# Altium schematic sheet WGA_IR_P.SchDoc
size A3
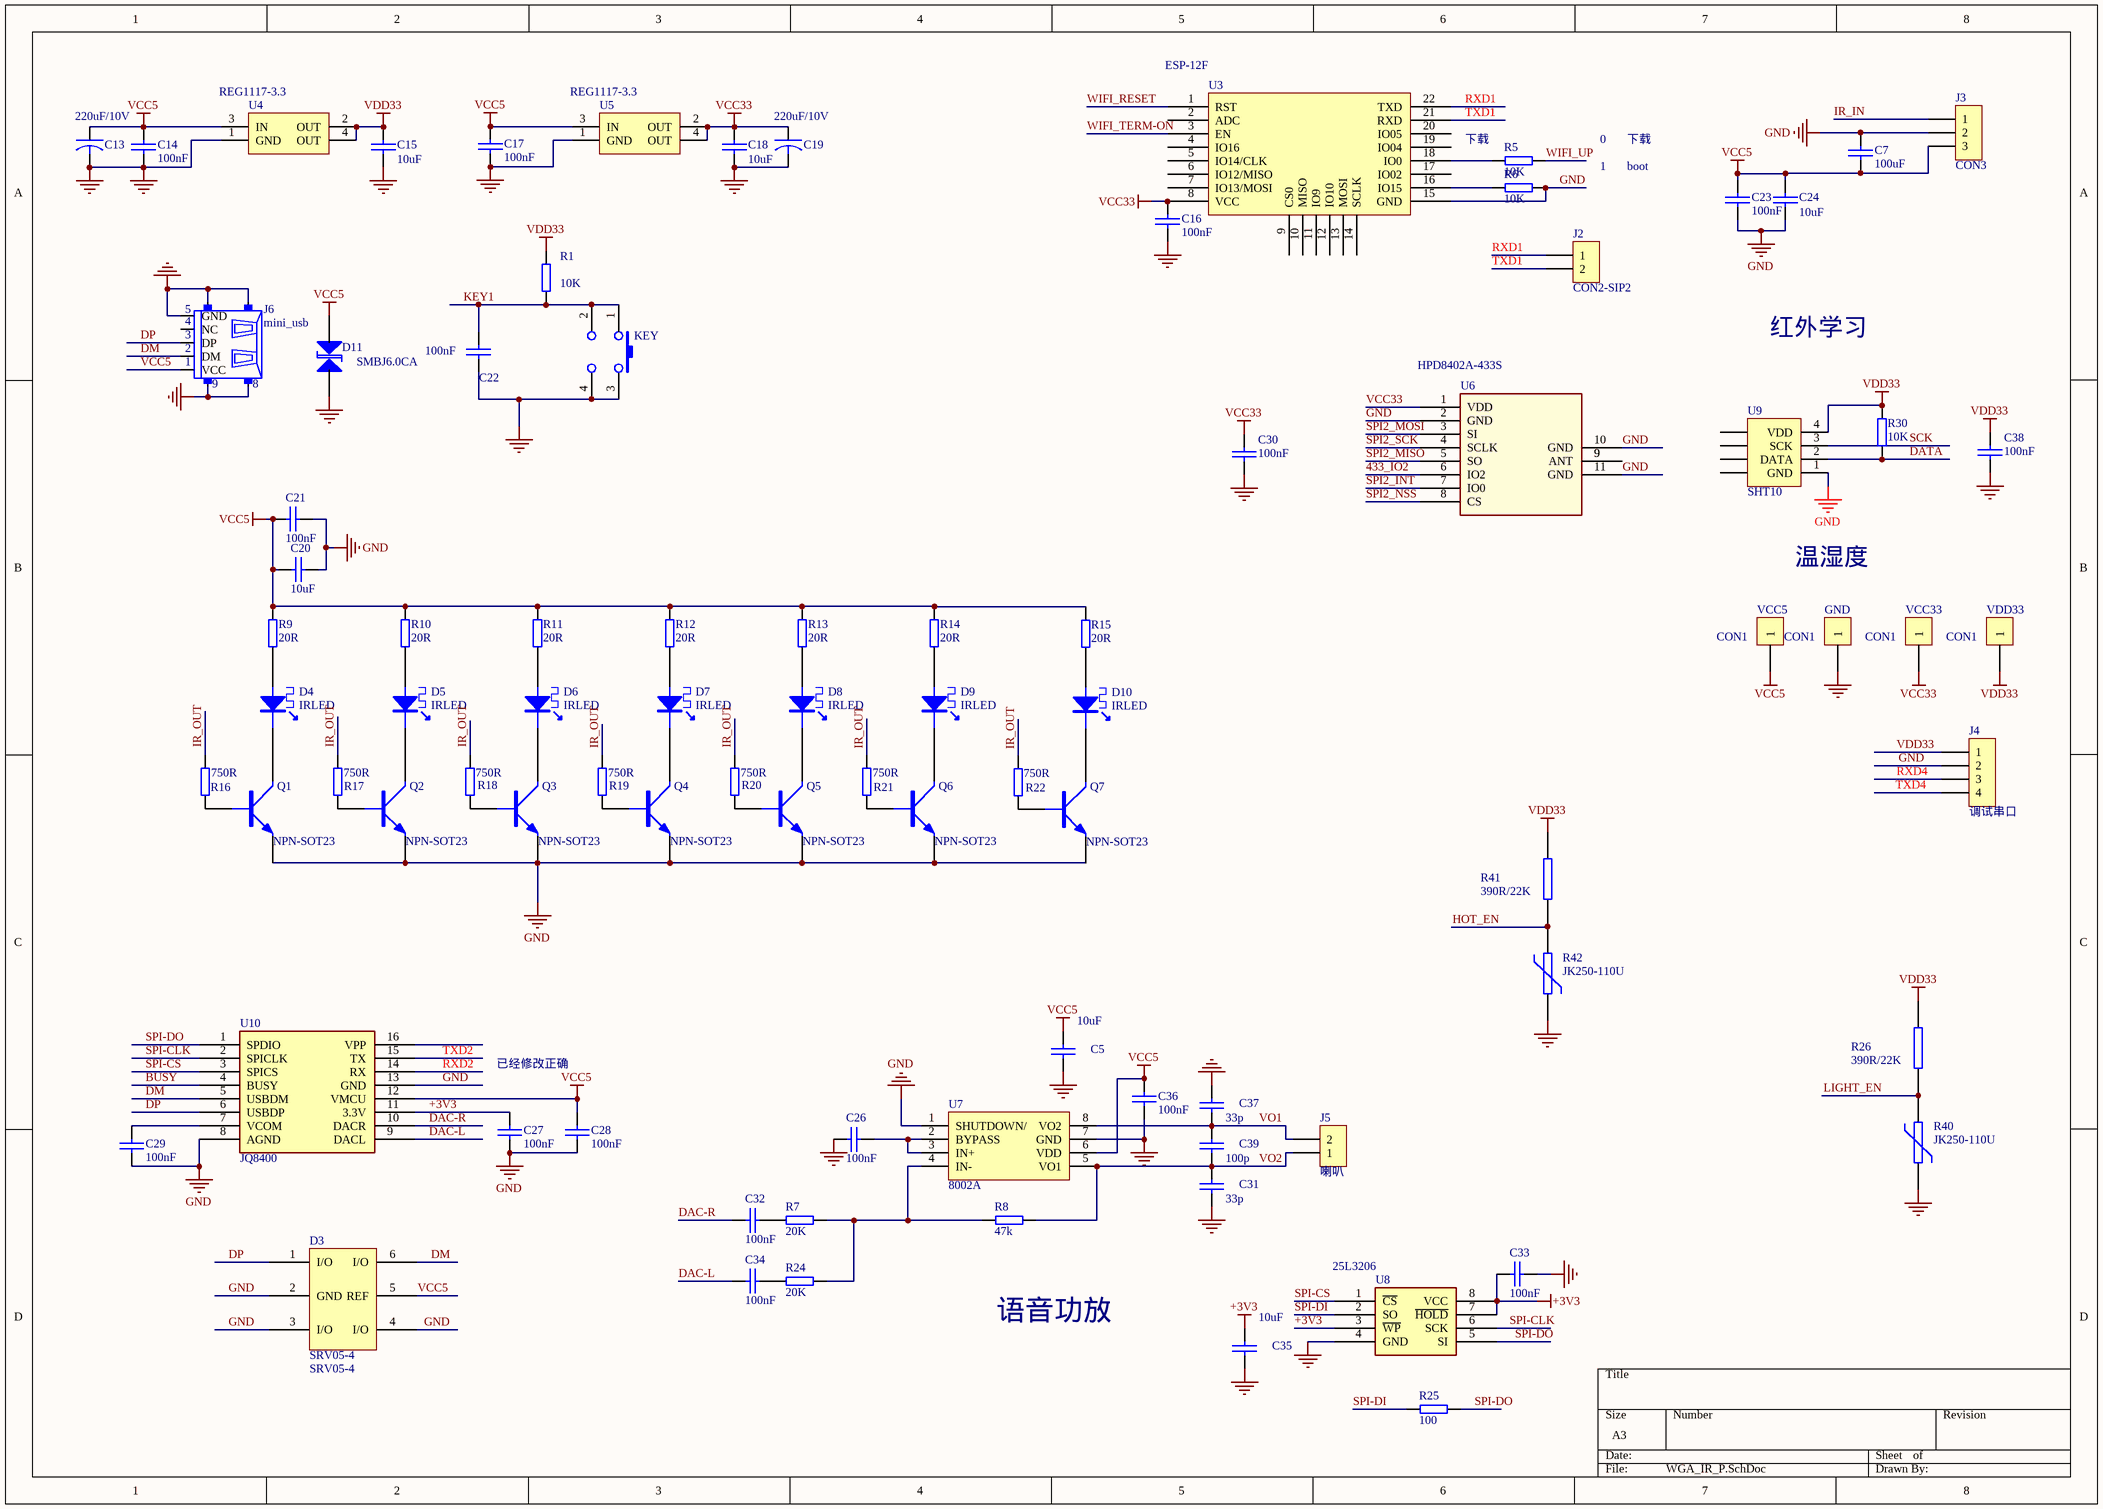
[diagram p0: WGA_IR_P.SchDoc]

## Parts
C5  value 10uF  [C0805]  (hidden comment: CC0805ZKY5V6BB106)
C7  value 100uF  [C0603]  (hidden comment: CC0603JRNPO9BN101)
C13  value 220uF/10V  [C6032]  (hidden comment: TAJC227K010RNJ)
C14  value 100nF  [C0603]  (hidden comment: CC0603ZRY5V9BB104)
C15  value 10uF  [C0805]  (hidden comment: CC0805ZKY5V6BB106)
C16  value 100nF  [C0603]  (hidden comment: CC0603ZRY5V9BB104)
C17  value 100nF  [C0603]  (hidden comment: CC0603ZRY5V9BB104)
C18  value 10uF  [C0805]  (hidden comment: CC0805ZKY5V6BB106)
C19  value 220uF/10V  [C6032]  (hidden comment: TAJC227K010RNJ)
C20  value 10uF  [C0805]  (hidden comment: CC0805ZKY5V6BB106)
C21  value 100nF  [C0603]  (hidden comment: CC0603ZRY5V9BB104)
C22  value 100nF  [C0603]  (hidden comment: CC0603ZRY5V9BB104)
C23  value 100nF  [C0603]  (hidden comment: CC0603ZRY5V9BB104)
C24  value 10uF  [C0805]  (hidden comment: CC0805ZKY5V6BB106)
C26  value 100nF  [C0603]  (hidden comment: CC0603ZRY5V9BB104)
C27  value 100nF  [C0603]  (hidden comment: CC0603ZRY5V9BB104)
C28  value 100nF  [C0603]  (hidden comment: CC0603ZRY5V9BB104)
C29  value 100nF  [C0603]  (hidden comment: CC0603ZRY5V9BB104)
C30  value 100nF  [C0603]  (hidden comment: CC0603ZRY5V9BB104)
C31  value 33p  [C0603]  (hidden comment: CC0603JRNPO9BN330)
C32  value 100nF  [C0603]  (hidden comment: CC0603ZRY5V9BB104)
C33  value 100nF  [C0603]  (hidden comment: CC0603ZRY5V9BB104)
C34  value 100nF  [C0603]  (hidden comment: CC0603ZRY5V9BB104)
C35  value 10uF  [C0805]  (hidden comment: CC0805ZKY5V6BB106)
C36  value 100nF  [C0603]  (hidden comment: CC0603ZRY5V9BB104)
C37  value 33p  [C0603]  (hidden comment: CC0603JRNPO9BN330)
C38  value 100nF  [C0603]  (hidden comment: CC0603ZRY5V9BB104)
C39  value 100p  [C0603]  (hidden comment: CC0603JRNPO9BN101)
D3  SRV05-4  [SRV05-4]
D4  IRLED  [T1-5MM - 2N]
D5  IRLED  [T1-5MM - 2N]
D6  IRLED  [T1-5MM - 2N]
D7  IRLED  [T1-5MM - 2N]
D8  IRLED  [T1-5MM - 2N]
D9  IRLED  [T1-5MM - 2N]
D10  IRLED  [T1-5MM - 2N]
D11  SMBJ6.0CA  [D3528]
GND  CON1  [PAD]
J2  CON2-SIP2  [SIP2]
J3  CON3  [TO-92C]
J4  调试串口  [SIP4]
J5  喇叭  [加盖喇叭]
J6  value mini_usb  [MICRO_USB-B]  (hidden comment: 0675031020)
KEY  SW-PB 4  [SWITCH(6*6*7)]  (value not drawn)
Q1  NPN-SOT23  [SOT23]
Q2  NPN-SOT23  [SOT23]
Q3  NPN-SOT23  [SOT23]
Q4  NPN-SOT23  [SOT23]
Q5  NPN-SOT23  [SOT23]
Q6  NPN-SOT23  [SOT23]
Q7  NPN-SOT23  [SOT23]
R1  value 10K  [R0603]  (hidden comment: RC0603JR-0710KL)
R5  value 10K  [R0603]  (hidden comment: RC0603JR-0710KL)
R6  value 10K  [R0603]  (hidden comment: RC0603JR-0710KL)
R7  value 20K  [R0603]  (hidden comment: RC0603JR-0720KL)
R8  value 47k  [R0603]  (hidden comment: RC0603JR-0747KL)
R9  value 20R  [R0603]  (hidden comment: RC0603JR-07470RL)
R10  value 20R  [R0603]  (hidden comment: RC0603JR-07470RL)
R11  value 20R  [R0603]  (hidden comment: RC0603JR-07470RL)
R12  value 20R  [R0603]  (hidden comment: RC0603JR-07470RL)
R13  value 20R  [R0603]  (hidden comment: RC0603JR-07470RL)
R14  value 20R  [R0603]  (hidden comment: RC0603JR-07470RL)
R15  value 20R  [R0603]  (hidden comment: RC0603JR-07470RL)
R16  value 750R  [R0603]  (hidden comment: R0603)
R17  value 750R  [R0603]  (hidden comment: R0603)
R18  value 750R  [R0603]  (hidden comment: R0603)
R19  value 750R  [R0603]  (hidden comment: R0603)
R20  value 750R  [R0603]  (hidden comment: R0603)
R21  value 750R  [R0603]  (hidden comment: R0603)
R22  value 750R  [R0603]  (hidden comment: R0603)
R24  value 20K  [R0603]  (hidden comment: RC0603JR-0720KL)
R25  value 100  [R0603]  (hidden comment: RC0603JR-07100RL)
R26  390R/22K  [R0603]
R30  value 10K  [R0603]  (hidden comment: RC0603JR-0710KL)
R40  JK250-110U  [JK250-110U]
R41  390R/22K  [R0603]
R42  JK250-110U  [JK250-110U]
U3  value ESP-12F  [ESP-12F]  (hidden comment: ESP8266-12F)
U4  value REG1117-3.3  [SOT223]  (hidden comment: REG1117-3.3/2K5)
U5  value REG1117-3.3  [SOT223]  (hidden comment: REG1117-3.3/2K5)
U6  HPD8402A-433S  [HPD8402A-433S]
U7  8002A  [SO8]
U8  value 25L3206  [SSOP8]  (hidden comment: MX25L3206EM2I-12G)
U9  SHT10  [SHT10]
U10  JQ8400  [SOP16]
VCC5  CON1  [PAD]
VCC33  CON1  [PAD]
VDD33  CON1  [PAD]

## Nets
+3V3: C27.1 C33.1 C35.1 U8.3(~{WP}) U8.7(~{HOLD}) U8.8(VCC) U10.11(3.3V)
GND: C5.2 C7.2 C13.2 C14.1 C15.2 C16.2 C17.1 C18.2 C19.2 C20.2 C21.2 C22.2 C23.2 C24.2 C26.2 C27.2 C28.2 C29.1 C30.2 C31.2 C33.2 C35.2 C36.1 C37.1 C38.2 D3.2(GND) D3.3(I/O) D3.4(I/O) D11.1 GND.1 J3.2 J4.2 J6.5(GND) J6.6 J6.7 J6.8 J6.9 KEY.3 KEY.4 Q1.2(E) Q2.2(E) Q3.2(E) Q4.2(E) Q5.2(E) Q6.2(E) Q7.2(E) R6.1 R40.1 R42.1 U3.15(GND) U4.1(GND) U5.1(GND) U6.2(GND) U6.10(GND) U6.11(GND) U7.1(SHUTDOWN/) U7.7(GND) U8.4(GND) U9.1(GND) U10.8(AGND) U10.13(GND)
VCC5: C5.1 C7.1 C13.1 C14.2 C17.2 C20.1 C21.1 C23.1 C24.1 C28.1 C36.2 D3.5(REF) D11.2 J3.3 J6.1(VCC) R9.2 R10.2 R11.2 R12.2 R13.2 R14.2 R15.2 U4.3(IN) U5.3(IN) U7.6(VDD) U10.12(VMCU) VCC5.1
VCC33: C16.1 C18.1 C19.1 C30.1 U3.8(VCC) U5.2(OUT) U5.4(OUT) U6.1(VDD) VCC33.1
VDD33: C15.1 C38.1 J4.1 R1.1 R26.2 R30.2 R41.2 U4.2(OUT) U4.4(OUT) U9.4(VDD) VDD33.1
433_IO2: U6.6(IO2)
BUSY: U10.4(BUSY)
DAC-L: C34.2 U10.9(DACL)
DAC-R: C32.2 U10.10(DACR)
DATA: R30.1 U9.2(DATA)
DM: D3.6(I/O) J6.2(DM) U10.5(USBDM)
DP: D3.1(I/O) J6.3(DP) U10.6(USBDP)
HOT_EN: R41.1 R42.2
IR_IN: J3.1
IR_OUT: R16.2 R17.2 R18.2 R19.2 R20.2 R21.2 R22.2
KEY1: C22.1 KEY.1 KEY.2 R1.2
LIGHT_EN: R26.1 R40.2
RXD1: J2.1 U3.22(TXD)
RXD2: U10.14(RX)
RXD4: J4.3
SCK: U9.3(SCK)
SPI2_INT: U6.7(IO0)
SPI2_MISO: U6.5(SO)
SPI2_MOSI: U6.3(SI)
SPI2_NSS: U6.8(CS)
SPI2_SCK: U6.4(SCLK)
SPI-CLK: U8.6(SCK) U10.2(SPICLK)
SPI-CS: U8.1(~{CS}) U10.3(SPICS)
SPI-DI: R25.1 U8.2(SO)
SPI-DO: R25.2 U8.5(SI) U10.1(SPDIO)
TXD1: J2.2 U3.21(RXD)
TXD2: U10.15(TX)
TXD4: J4.4
VO1: C37.2 C39.1 J5.2 U7.8(VO2)
VO2: C31.1 C39.2 J5.1 R8.2 U7.5(VO1)
WIFI_RESET: U3.1(RST)
WIFI_TERM-ON: U3.3(EN)
WIFI_UP: R5.1
NetC26_1: C26.1 U7.2(BYPASS) U7.3(IN+)
NetC29_2: C29.2 U10.7(VCOM)
NetC32_1: C32.1 R7.2
NetC34_1: C34.1 R24.2
NetD4_1: D4.1 R9.1
NetD4_2: D4.2 Q1.3(C)
NetD5_1: D5.1 R10.1
NetD5_2: D5.2 Q2.3(C)
NetD6_1: D6.1 R11.1
NetD6_2: D6.2 Q3.3(C)
NetD7_1: D7.1 R12.1
NetD7_2: D7.2 Q4.3(C)
NetD8_1: D8.1 R13.1
NetD8_2: D8.2 Q5.3(C)
NetD9_1: D9.1 R14.1
NetD9_2: D9.2 Q6.3(C)
NetD10_1: D10.1 R15.1
NetD10_2: D10.2 Q7.3(C)
NetQ1_1: Q1.1(B) R16.1
NetQ2_1: Q2.1(B) R17.1
NetQ3_1: Q3.1(B) R18.1
NetQ4_1: Q4.1(B) R19.1
NetQ5_1: Q5.1(B) R20.1
NetQ6_1: Q6.1(B) R21.1
NetQ7_1: Q7.1(B) R22.1
NetR5_2: R5.2 U3.18(IO0)
NetR6_2: R6.2 U3.16(IO15)
NetR7_1: R7.1 R8.1 R24.1 U7.4(IN-)

Not connected (* = marked no-connect by the designer): J6 4(NC); U3 2(ADC) 4(IO16) 5(IO14/CLK) 6(IO12/MISO) 7(IO13/MOSI) 9(CS0) 10(MISO) 11(IO9) 12(IO10) 13(MOSI) 14(SCLK) 17(IO02) 19(IO04) 20(IO05); U6 9(ANT); U9 5(nc) 6(nc) 7(nc) 8(nc); U10 16(VPP)

## Notes on the sheet
- 下载
- 0
- 1
- boot
- 红外学习
- 温湿度
- 已经修改正确
- 语音功放

## Library data of the parts
C5 C15 C18 C20 C24 C35 = C0805_10uF: CAP CER 10UF 10V Y5V 0805; Manufacturer: Yageo; Unit Cost: 0.08; Category: Capacitors; Manufacturer Part Number: CC0805ZKY5V6BB106; Part Number: CC0805ZKY5V6BB106; RoHs: Lead free / RoHS Compliant; Subcategory: Ceramic Capacitors
C7 C39 = C0603_100p: CAP CER 100PF 50V 5% NPO 0603; Manufacturer: Yageo; Unit Cost: 0.04; Category: Capacitors; Manufacturer Part Number: CC0603JRNPO9BN101; Part Number: CC0603JRNPO9BN101; RoHs: Lead free / RoHS Compliant; Subcategory: Ceramic Capacitors
C13 C19 = C6032_220uF_10V: CAP TANT 220UF 10V 10% 2312; Manufacturer: AVX Corporation; Unit Cost: 0.3; Category: Capacitors; Manufacturer Part Number: TAJC227K010RNJ; Part Number: TAJC227K010RNJ; RoHs: Lead free / RoHS Compliant; Subcategory: Tantalum Capacitors
C14 C16 C17 C21-C23 C26-C30 C32-C34 C36 C38 = C0603_100nF: CAP CER 0.1UF 50V Y5V 0603; Manufacturer: Yageo; Unit Cost: 0.04; Category: Capacitors; Manufacturer Part Number: CC0603ZRY5V9BB104; Part Number: CC0603ZRY5V9BB104; Subcategory: Ceramic Capacitors
C31 C37 = C0603_33p: CAP CER 33PF 50V 5% NPO 0603; Manufacturer: Yageo; Unit Cost: 0.04; Category: Capacitors; Manufacturer Part Number: CC0603JRNPO9BN330; Part Number: CC0603JRNPO9BN330; RoHs: Lead free / RoHS Compliant; Subcategory: Ceramic Capacitors
D3 = SRV05-4: TVS SOT-26; Value: SRV05-4
D11 = D3528_TVS_6.0: TVS DIODE 6VWM 10.3VC SMB; Manufacturer: Littelfuse Inc; Unit Cost: 0.3; Category: Circuit Protection; Manufacturer Part Number: SMBJ6.0CA; Part Number: SMBJ6.0CA; Subcategory: TVS - Diodes; Value: SMBJ6.0CA
GND VCC5 VCC33 VDD33 = CON1: Connector
J2 = CON2-SIP2: Connector
J3 = CON3: Connector; Category: connector
J4 = CON4: 2.54mm dip
J5 = CON2: 8欧 0.5w 直径10mm
J6 = MINI_USB: CONN RECEPT MINIUSB R/A 5POS SMD; Manufacturer: Molex Inc; Category: Connectors; Manufacturer Part Number: 0675031020; Part Number: 0675031020; RoHs: Lead free / RoHS Compliant; Subcategory: USB Connectors
Q1-Q7 = NPN-SOT23: NPN Transistor
R1 R5 R6 R30 = R0603_10K_5%: RES 10K OHM 1/10W 5% 0603 SMD; Manufacturer: Yageo; Unit Cost: 0.005; Category: Resistor; Manufacturer Part Number: RC0603JR-0710KL; Part Number: RC0603JR-0710KL; RoHs: Lead free / RoHS Compliant; Subcategory: ThickFilm
R7 R24 = R0603_20K_5%: RES 20K OHM 1/10W 5% 0603 SMD; Manufacturer: Yageo; Unit Cost: 0.005; Category: Resistor; Manufacturer Part Number: RC0603JR-0720KL; Part Number: RC0603JR-0720KL; RoHs: Lead free / RoHS Compliant; Subcategory: ThickFilm
R8 = R0603_47K_5%: RES 47K OHM 1/10W 5% 0603 SMD; Manufacturer: Yageo; Unit Cost: 0.005; Category: Resistor; Manufacturer Part Number: RC0603JR-0747KL; Part Number: RC0603JR-0747KL; RoHs: Lead free / RoHS Compliant; Subcategory: ThickFilm
R9-R15 = R0603_470_5%: RES 470 OHM 1/10W 5% 0603 SMD; Manufacturer: Yageo; Unit Cost: 0.005; Category: Resistor; Manufacturer Part Number: RC0603JR-07470RL; Part Number: RC0603JR-07470RL; RoHs: Lead free / RoHS Compliant; Subcategory: ThickFilm
R16-R22 = R0603: Manufacturer: Yageo; Unit Cost: 0.005; Category: Resistor; RoHs: Lead free / RoHS Compliant; Subcategory: ThickFilm
R25 = R0603_100_5%: RES 100 OHM 1/10W 5% 0603 SMD; Manufacturer: Yageo; Unit Cost: 0.005; Category: Resistor; Manufacturer Part Number: RC0603JR-07100RL; Part Number: RC0603JR-07100RL; RoHs: Lead free / RoHS Compliant; Subcategory: ThickFilm
R26 R41 = RES-0805: 贴片电阻; 备注: 室外照度功能时焊接22K,室内照度功能时焊接390R
R40 R42 = PTC: Category: Circuit Protection; Subcategory: PTC
U3 = ESP8266-12F: WIFI ESP-12F  ESP8266; Manufacturer: 安信可; Manufacturer Part Number: ESP-12F
U4 U5 = REG1117-3.3: IC REG LDO 3.3V 0.8A SOT223; Manufacturer: Texas Instruments; Category: Integrated Circuits (ICs); Manufacturer Part Number: REG1117-3.3/2K5; Part Number: REG1117-3.3/2K5; RoHs: Lead free / RoHS Compliant; Subcategory: PMIC - Voltage Regulators - Linear (LDO)
U6 = HPD8402A-433S: RF TXRX MODULE CC1101 433Mhz; Manufacturer: PDTeK(合普顿科技); Unit Cost: 13; Category: 433MHz MODULE; Manufacturer Part Number: HPD8402A-433S; Part Number: HPD8402A-433S; Value: HPD8402A-433S
U7 = LM4890
U8 = 25L3206: IC FLASH 32MBIT 86MHZ 8SOP 32M (4M x 8); Manufacturer: Macronix; Category: Integrated Circuits (ICs); Manufacturer Part Number: MX25L3206EM2I-12G; Part Number: MX25L3206EM2I-12G; Subcategory: Memory
U9 = SHT10: 贴片温湿度传感器SHT10; 类型: 贴片; 元件类型: 温湿度传感器; 品牌: SENSIRION
U10 = JQ8400: Manufacturer: 深圳佳强电子科技有限公司; Category: Integrated Circuits (ICs); Manufacturer Part Number: JQ8400; Part Number: JQ8400; Subcategory: Audio; Value: JQ8400